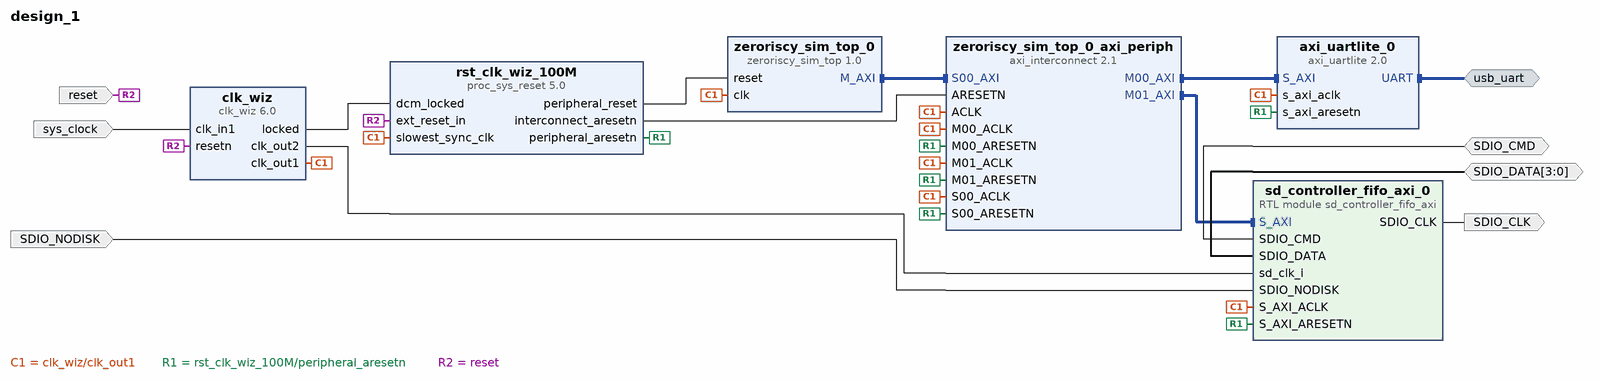
[diagram p0: block diagram of the top level]
# Vivado block design design_1, xc7a35ticsg324-1L, Vivado 2018.1
create_bd_design design_1

create_bd_intf_port -mode Master -vlnv xilinx.com:interface:uart_rtl:1.0 usb_uart
create_bd_port -dir O -type clk SDIO_CLK
create_bd_port -dir IO SDIO_CMD
create_bd_port -dir IO -from 3 -to 0 SDIO_DATA
create_bd_port -dir I SDIO_NODISK
create_bd_port -dir I -type rst reset
set_property -dict {CONFIG.POLARITY ACTIVE_LOW} [get_bd_ports reset]
create_bd_port -dir I -type clk sys_clock
set_property -dict {CONFIG.FREQ_HZ 100000000 CONFIG.PHASE 0.000} [get_bd_ports sys_clock]

create_bd_cell -type module -reference sd_controller_fifo_axi sd_controller_fifo_axi_0
create_bd_cell -type ip -vlnv xilinx.com:ip:axi_uartlite:2.0 axi_uartlite_0
set_property -dict [list \
  CONFIG.C_BAUDRATE 19200 \
  CONFIG.USE_BOARD_FLOW true \
  CONFIG.UARTLITE_BOARD_INTERFACE usb_uart \
] [get_bd_cells axi_uartlite_0]
create_bd_cell -type ip -vlnv xilinx.com:ip:axi_interconnect:2.1 zeroriscy_sim_top_0_axi_periph
set_property -dict {CONFIG.NUM_MI 2} [get_bd_cells zeroriscy_sim_top_0_axi_periph]
create_bd_cell -type ip -vlnv xilinx.com:ip:clk_wiz:6.0 clk_wiz
set_property -dict [list \
  CONFIG.CLKOUT2_USED true \
  CONFIG.NUM_OUT_CLKS 2 \
  CONFIG.CLKOUT2_REQUESTED_OUT_FREQ 25 \
  CONFIG.RESET_PORT resetn \
  CONFIG.MMCM_DIVCLK_DIVIDE 1 \
  CONFIG.MMCM_CLKOUT1_DIVIDE 40 \
  CONFIG.RESET_TYPE ACTIVE_LOW \
  CONFIG.USE_BOARD_FLOW true \
  CONFIG.CLK_IN1_BOARD_INTERFACE sys_clock \
  CONFIG.RESET_BOARD_INTERFACE reset \
  CONFIG.CLKOUT2_JITTER 175.402 \
  CONFIG.CLKOUT2_PHASE_ERROR 98.575 \
] [get_bd_cells clk_wiz]
create_bd_cell -type ip -vlnv xilinx.com:ip:proc_sys_reset:5.0 rst_clk_wiz_100M
set_property -dict {CONFIG.USE_BOARD_FLOW true CONFIG.RESET_BOARD_INTERFACE reset} [get_bd_cells rst_clk_wiz_100M]
create_bd_cell -type ip -vlnv xilinx.com:user:zeroriscy_sim_top:1.0 zeroriscy_sim_top_0

# ---- connections ----

connect_bd_intf_net [get_bd_intf_pins zeroriscy_sim_top_0/M_AXI] [get_bd_intf_pins zeroriscy_sim_top_0_axi_periph/S00_AXI]
connect_bd_intf_net [get_bd_intf_pins zeroriscy_sim_top_0_axi_periph/M00_AXI] [get_bd_intf_pins axi_uartlite_0/S_AXI]
connect_bd_intf_net [get_bd_intf_pins zeroriscy_sim_top_0_axi_periph/M01_AXI] [get_bd_intf_pins sd_controller_fifo_axi_0/S_AXI]
connect_bd_intf_net [get_bd_intf_ports usb_uart] [get_bd_intf_pins axi_uartlite_0/UART]
connect_bd_net [get_bd_pins clk_wiz/clk_out1] \
  [get_bd_pins sd_controller_fifo_axi_0/S_AXI_ACLK] [get_bd_pins axi_uartlite_0/s_axi_aclk] \
  [get_bd_pins rst_clk_wiz_100M/slowest_sync_clk] [get_bd_pins zeroriscy_sim_top_0_axi_periph/ACLK] \
  [get_bd_pins zeroriscy_sim_top_0_axi_periph/S00_ACLK] [get_bd_pins zeroriscy_sim_top_0_axi_periph/M00_ACLK] \
  [get_bd_pins zeroriscy_sim_top_0_axi_periph/M01_ACLK] [get_bd_pins zeroriscy_sim_top_0/clk]
connect_bd_net [get_bd_pins sd_controller_fifo_axi_0/SDIO_CLK] [get_bd_ports SDIO_CLK]
connect_bd_net [get_bd_ports SDIO_CMD] [get_bd_pins sd_controller_fifo_axi_0/SDIO_CMD]
connect_bd_net [get_bd_ports SDIO_DATA] [get_bd_pins sd_controller_fifo_axi_0/SDIO_DATA]
connect_bd_net -net SDIO_NODISK_0_1 [get_bd_ports SDIO_NODISK] [get_bd_pins sd_controller_fifo_axi_0/SDIO_NODISK]
connect_bd_net [get_bd_pins clk_wiz/locked] [get_bd_pins rst_clk_wiz_100M/dcm_locked]
connect_bd_net [get_bd_pins rst_clk_wiz_100M/peripheral_aresetn] \
  [get_bd_pins sd_controller_fifo_axi_0/S_AXI_ARESETN] [get_bd_pins axi_uartlite_0/s_axi_aresetn] \
  [get_bd_pins zeroriscy_sim_top_0_axi_periph/S00_ARESETN] [get_bd_pins zeroriscy_sim_top_0_axi_periph/M00_ARESETN] \
  [get_bd_pins zeroriscy_sim_top_0_axi_periph/M01_ARESETN]
connect_bd_net [get_bd_ports reset] [get_bd_pins rst_clk_wiz_100M/ext_reset_in] [get_bd_pins clk_wiz/resetn]
connect_bd_net [get_bd_ports sys_clock] [get_bd_pins clk_wiz/clk_in1]
connect_bd_net [get_bd_pins clk_wiz/clk_out2] [get_bd_pins sd_controller_fifo_axi_0/sd_clk_i]
connect_bd_net [get_bd_pins rst_clk_wiz_100M/peripheral_reset] [get_bd_pins zeroriscy_sim_top_0/reset]
connect_bd_net [get_bd_pins rst_clk_wiz_100M/interconnect_aresetn] [get_bd_pins zeroriscy_sim_top_0_axi_periph/ARESETN]

# ---- address map ----
assign_bd_address -offset 0x9A101000 -range 4K -target_address_space [get_bd_addr_spaces zeroriscy_sim_top_0/M_AXI] [get_bd_addr_segs axi_uartlite_0/S_AXI/Reg]
assign_bd_address -offset 0x9A102000 -range 4K -target_address_space [get_bd_addr_spaces zeroriscy_sim_top_0/M_AXI] [get_bd_addr_segs sd_controller_fifo_axi_0/S_AXI/reg0]

validate_bd_design
save_bd_design
